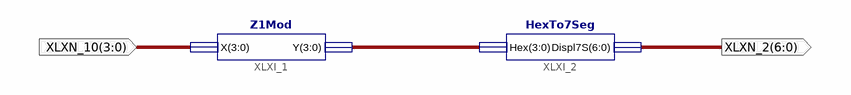
[diagram p0: schematic sheet 1]
// Xilinx ISE schematic Z2.sch (xc9500xl) as structural Verilog: 2 symbols, 2 ports
module Z2 (
  input  [3:0] XLXN_10,
  output [6:0] XLXN_2
);

  wire [3:0] XLXN_1;

  Z1Mod XLXI_1 (.X(XLXN_10), .Y(XLXN_1));
  HexTo7Seg XLXI_2 (.Hex(XLXN_1), .Displ7S(XLXN_2));
endmodule
